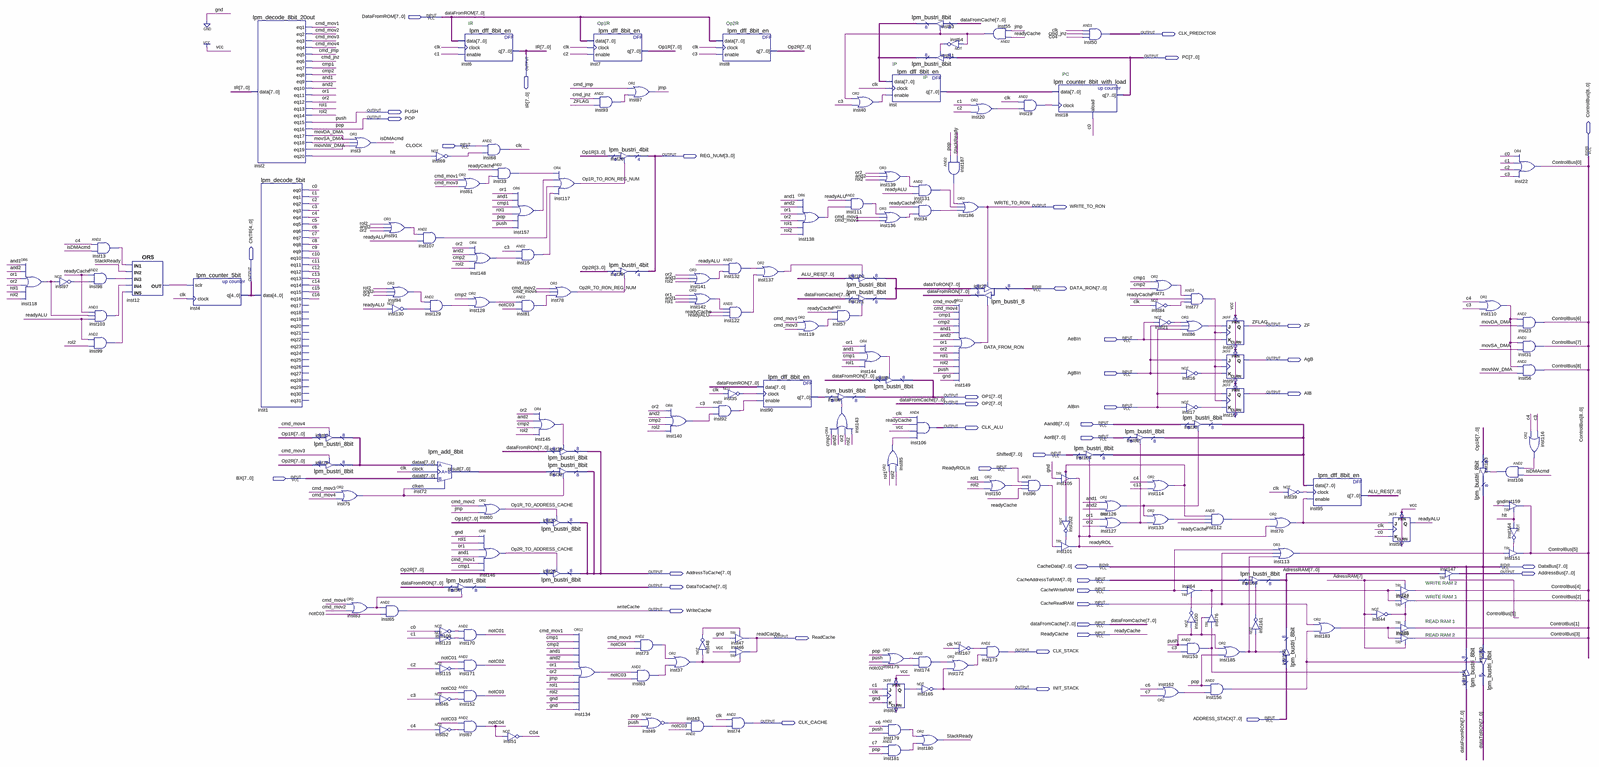
[diagram p0: schematic sheet, whole]
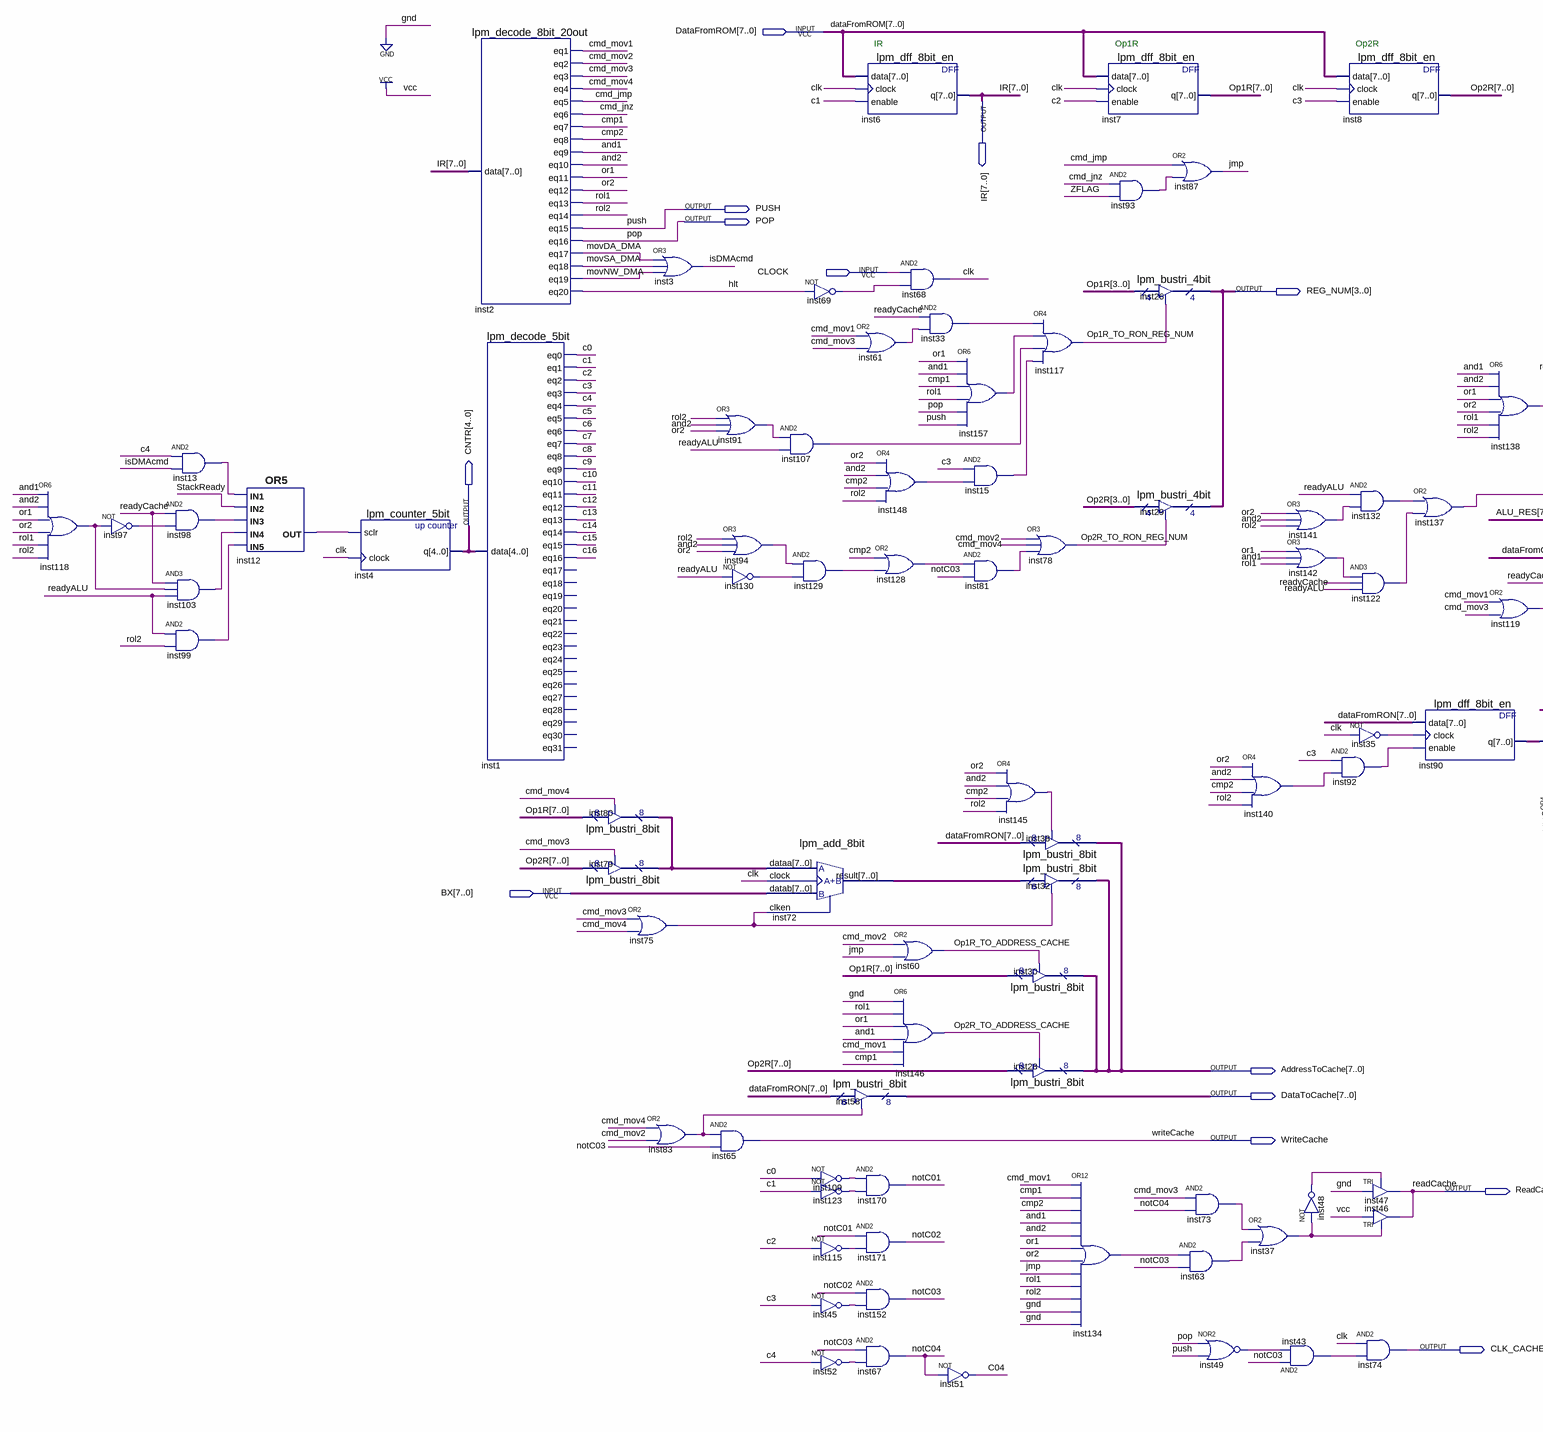
[diagram p1: schematic sheet, left part]
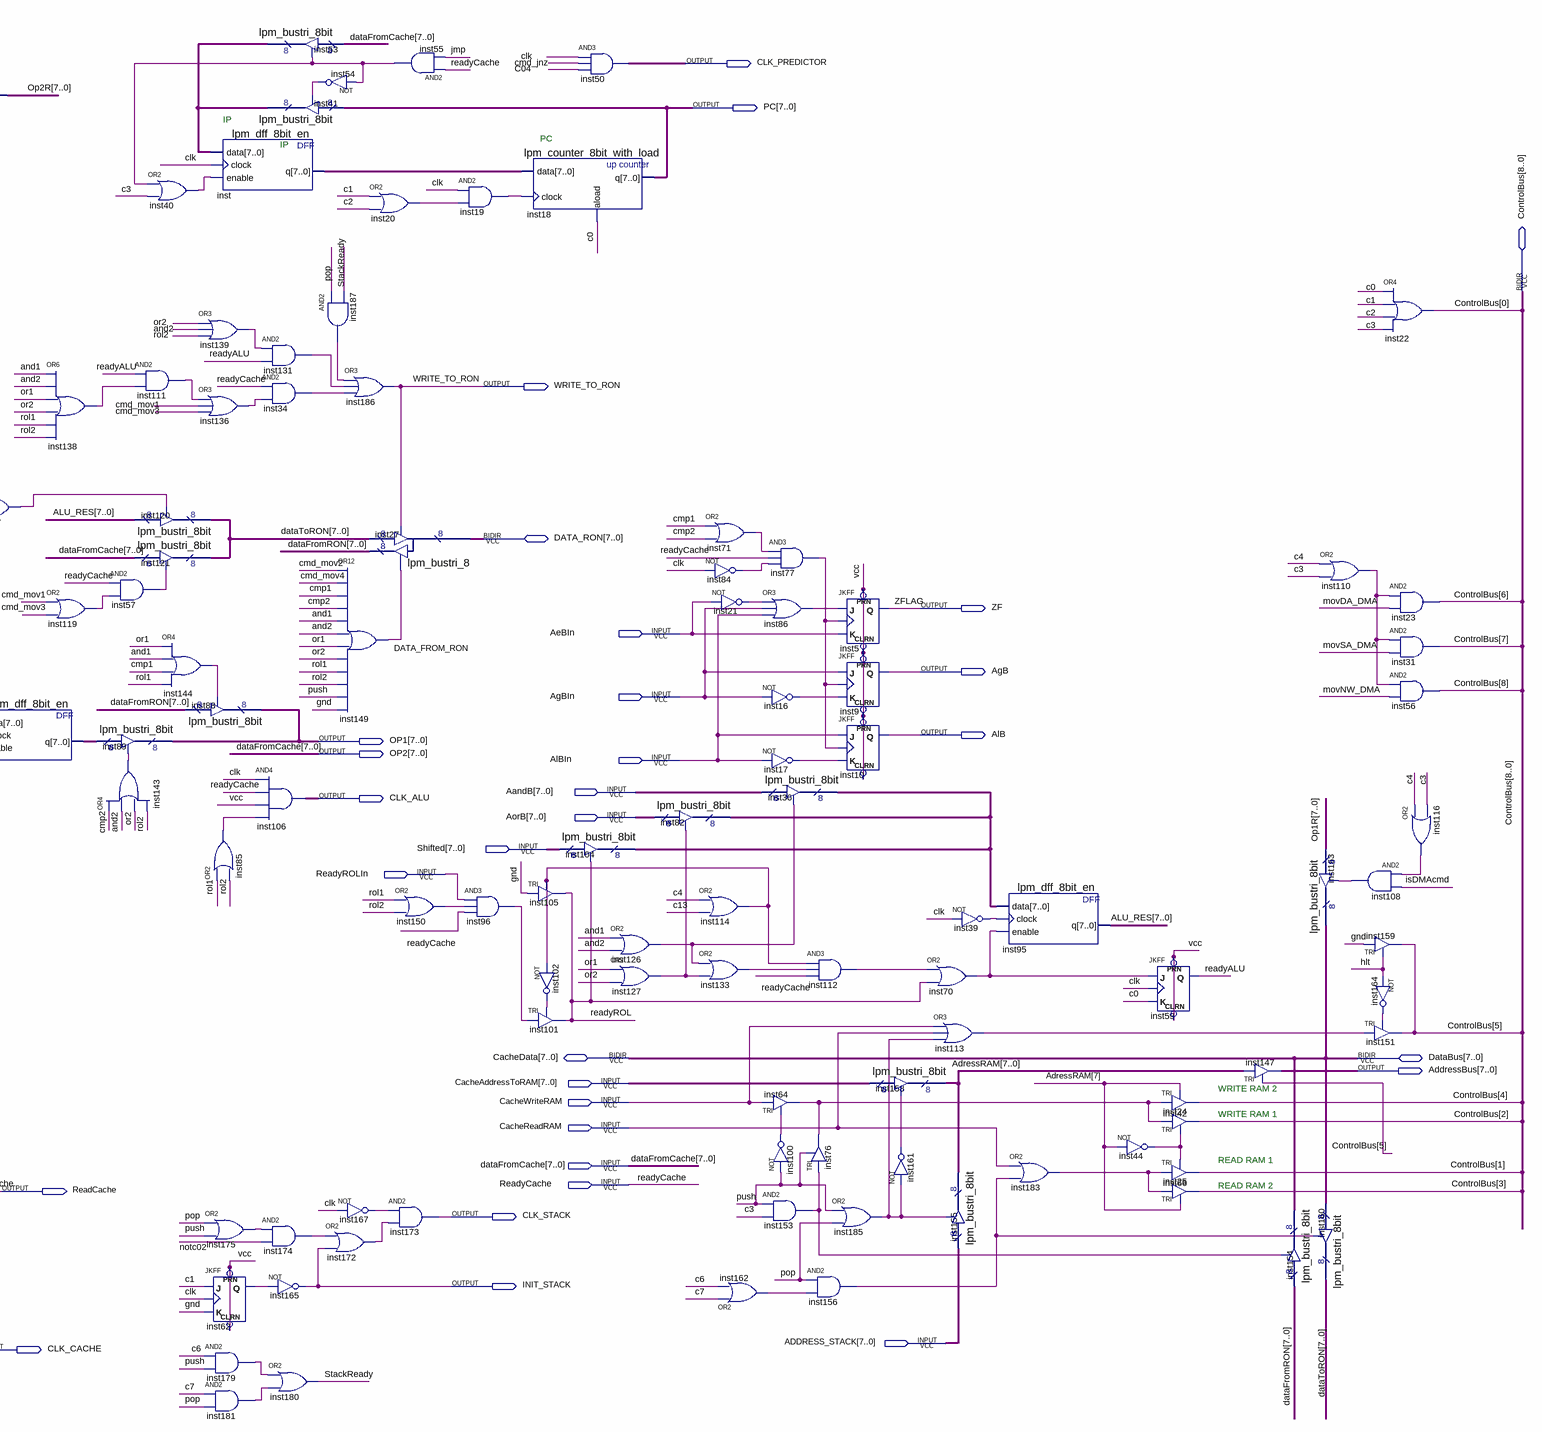
[diagram p2: schematic sheet, right part]
// Quartus schematic CPUManager.bdf as structural Verilog: 175 symbols, 42 pins
module CPUManager (
  input  [7:0] DataFromROM,
  input  CLOCK,
  input  AeBIn,
  input  AgBIn,
  input  AlBIn,
  input  [7:0] AandB,
  input  [7:0] AorB,
  input  [7:0] Shifted,
  input  ReadyROLIn,
  input  [7:0] BX,
  input  [7:0] CacheAddressToRAM,
  input  CacheWriteRAM,
  input  CacheReadRAM,
  input  [7:0] dataFromCache,
  input  ReadyCache,
  input  [7:0] ADDRESS_STACK,
  inout  [8:0] ControlBus,
  inout  [7:0] DATA_RON,
  inout  [7:0] CacheData,
  inout  [7:0] DataBus,
  output CLK_PREDICTOR,
  output [7:0] IR,
  output [7:0] PC,
  output PUSH,
  output POP,
  output [3:0] REG_NUM,
  output WRITE_TO_RON,
  output [4:0] CNTR,
  output ZF,
  output AgB,
  output AlB,
  output [7:0] OP1,
  output [7:0] OP2,
  output CLK_ALU,
  output [7:0] AddressToCache,
  output [7:0] AddressBus,
  output [7:0] DataToCache,
  output WriteCache,
  output ReadCache,
  output CLK_STACK,
  output INIT_STACK,
  output CLK_CACHE
);

  wire and1, and2, c0, c1, c2, c3, c4, C04, c5, c6, c7, c8, c9, c10, c11, c12, c13, c14, c15, c16, clk,
       cmd_jmp, cmd_jnz, cmd_mov1, cmd_mov2, cmd_mov3, cmd_mov4, cmp1, cmp2, DATA_FROM_RON, hlt, inst12_out,
       inst13_out, inst15_out, inst16_out, inst17_out, inst19_out, inst20_out, inst21_out, inst33_out,
       inst34_out, inst35_out, inst37_out, inst39_out, inst40_out, inst43_out, inst44_out, inst45_out,
       inst48_out, inst49_out, inst52_out, inst54_out, inst55_out, inst57_out, inst61_out, inst62_q,
       inst63_out, inst64_out, inst69_out, inst70_out, inst71_out, inst73_out, inst75_out, inst77_out,
       inst81_out, inst83_out, inst84_out, inst85_out, inst86_out, inst91_out, inst92_out, inst93_out,
       inst94_out, inst96_out, inst97_out, inst98_out, inst99_out, inst100_out, inst102_out, inst103_out,
       inst107_out, inst108_out, inst109_out, inst110_out, inst111_out, inst112_out, inst113_out,
       inst114_out, inst115_out, inst116_out, inst118_out, inst119_out, inst122_out, inst123_out,
       inst126_out, inst127_out, inst128_out, inst129_out, inst130_out, inst131_out, inst132_out,
       inst133_out, inst134_out, inst136_out, inst137_out, inst138_out, inst139_out, inst140_out,
       inst141_out, inst142_out, inst143_out, inst144_out, inst145_out, inst148_out, inst150_out,
       inst153_out, inst156_out, inst157_out, inst161_out, inst162_out, inst164_out, inst167_out,
       inst172_out, inst174_out, inst175_out, inst179_out, inst181_out, inst183_out, inst185_out,
       inst187_out, isDMAcmd, jmp, movDA_DMA, movNW_DMA, movSA_DMA, notC01, notC02, notC03, notC04,
       Op1R_TO_ADDRESS_CACHE, Op1R_TO_RON_REG_NUM, Op2R_TO_ADDRESS_CACHE, Op2R_TO_RON_REG_NUM, or1, or2,
       readyALU, readyROL, rol1, rol2, StackReady;
  wire [7:0] AdressRAM, ALU_RES, dataFromRON, dataToRON, inst53_tridata, inst72_result, inst80_tridata,
       inst90_q, inst104_tridata, inst_q, Op1R, Op2R;

  or inst118 (inst118_out, and1, and2, or1, or2, rol1, rol2);
  not inst97 (inst97_out, inst118_out);
  and inst13 (inst13_out, c4, isDMAcmd);
  and inst98 (inst98_out, ReadyCache, inst97_out);
  and inst103 (inst103_out, ReadyCache, inst118_out, readyALU);
  and inst99 (inst99_out, readyALU, rol2);
  or inst12 (inst12_out, inst13_out, StackReady, inst98_out, inst103_out, inst99_out);
  lpm_counter_5bit inst4 (.sclr(inst12_out), .clock(clk), .q(CNTR));
  lpm_decode_8bit_20out inst2 (
    .data(IR), .eq1(cmd_mov1), .eq2(cmd_mov2), .eq3(cmd_mov3), .eq4(cmd_mov4), .eq5(cmd_jmp), .eq6(cmd_jnz),
    .eq7(cmp1), .eq8(cmp2), .eq9(and1), .eq10(and2), .eq11(or1), .eq12(or2), .eq13(rol1), .eq14(rol2),
    .eq15(PUSH), .eq16(POP), .eq17(movDA_DMA), .eq18(movSA_DMA), .eq19(movNW_DMA), .eq20(hlt));
  lpm_decode_5bit inst1 (
    .data(CNTR), .eq0(c0), .eq1(c1), .eq2(c2), .eq3(c3), .eq4(c4), .eq5(c5), .eq6(c6), .eq7(c7), .eq8(c8),
    .eq9(c9), .eq10(c10), .eq11(c11), .eq12(c12), .eq13(c13), .eq14(c14), .eq15(c15), .eq16(c16));  // open: eq17, eq18, eq19, eq20, eq21, eq22, eq23, eq24, eq25, eq26, eq27, eq28, eq29, eq30, eq31
  lpm_bustri_8bit inst80 (.enabledt(cmd_mov4), .data(Op1R), .tridata(inst80_tridata));
  lpm_bustri_8bit inst79 (.enabledt(cmd_mov3), .data(Op2R), .tridata(inst80_tridata));
  or inst3 (isDMAcmd, movDA_DMA, movSA_DMA, movNW_DMA);
  or inst75 (inst75_out, cmd_mov3, cmd_mov4);
  or inst83 (inst83_out, cmd_mov4, cmd_mov2);
  or inst91 (inst91_out, rol2, and2, or2);
  and inst65 (WriteCache, inst83_out, notC03);
  or inst94 (inst94_out, rol2, and2, or2);
  not inst130 (inst130_out, readyALU);
  lpm_add_8bit inst72 (.dataa(inst80_tridata), .datab(BX), .clock(clk), .clken(inst75_out), .result(inst72_result));
  not inst69 (inst69_out, hlt);
  and inst107 (inst107_out, inst91_out, readyALU);
  and inst129 (inst129_out, inst94_out, inst130_out);
  not inst109 (inst109_out, c0);
  not inst123 (inst123_out, c1);
  not inst115 (inst115_out, c2);
  not inst45 (inst45_out, c3);
  not inst52 (inst52_out, c4);
  lpm_dff_8bit_en inst6 (.data(DataFromROM), .clock(clk), .enable(c1), .q(IR));
  or inst61 (inst61_out, cmd_mov1, cmd_mov3);
  lpm_bustri_8bit inst58 (.enabledt(inst83_out), .data(dataFromRON), .tridata(DataToCache));
  and inst170 (notC01, inst109_out, inst123_out);
  and inst171 (notC02, notC01, inst115_out);
  and inst152 (notC03, notC02, inst45_out);
  and inst67 (notC04, notC03, inst52_out);
  and inst68 (clk, CLOCK, inst69_out);
  and inst33 (inst33_out, ReadyCache, inst61_out);
  or inst148 (inst148_out, or2, and2, cmp2, rol2);
  or inst128 (inst128_out, cmp2, inst129_out);
  or inst60 (Op1R_TO_ADDRESS_CACHE, cmd_mov2, jmp);
  or inst146 (Op2R_TO_ADDRESS_CACHE, 1'b0, rol1, or1, and1, cmd_mov1, cmp1);
  or inst157 (inst157_out, or1, and1, cmp1, rol1, POP, PUSH);
  and inst15 (inst15_out, c3, inst148_out);
  and inst81 (inst81_out, inst128_out, notC03);
  not inst51 (C04, notC04);
  or inst145 (inst145_out, or2, and2, cmp2, rol2);
  lpm_bustri_8bit inst38 (.enabledt(inst145_out), .data(dataFromRON), .tridata(AddressToCache));
  lpm_bustri_8bit inst32 (.enabledt(inst75_out), .data(inst72_result), .tridata(AddressToCache));
  lpm_bustri_8bit inst30 (.enabledt(Op1R_TO_ADDRESS_CACHE), .data(Op1R), .tridata(AddressToCache));
  lpm_bustri_8bit inst28 (.enabledt(Op2R_TO_ADDRESS_CACHE), .data(Op2R), .tridata(AddressToCache));
  or inst117 (Op1R_TO_RON_REG_NUM, inst33_out, inst157_out, inst107_out, inst15_out);
  or inst78 (Op2R_TO_RON_REG_NUM, cmd_mov2, cmd_mov4, inst81_out);
  or inst134 (inst134_out, cmd_mov1, cmp1, cmp2, and1, and2, or1, or2, jmp, rol1, rol2, 1'b0, 1'b0);
  lpm_dff_8bit_en inst7 (.data(DataFromROM), .clock(clk), .enable(c2), .q(Op1R));
  and inst93 (inst93_out, cmd_jnz, ZF);
  or inst87 (jmp, cmd_jmp, inst93_out);
  lpm_bustri_4bit inst26 (.enabledt(Op1R_TO_RON_REG_NUM), .data(Op1R[3:0]), .tridata(REG_NUM));
  lpm_bustri_4bit inst29 (.enabledt(Op2R_TO_RON_REG_NUM), .data(Op2R[3:0]), .tridata(REG_NUM));
  and inst73 (inst73_out, cmd_mov3, notC04);
  and inst63 (inst63_out, inst134_out, notC03);
  nor inst49 (inst49_out, POP, PUSH);
  or inst140 (inst140_out, or2, and2, cmp2, rol2);
  or inst37 (inst37_out, inst73_out, inst63_out);
  or inst141 (inst141_out, or2, and2, rol2);
  or inst142 (inst142_out, or1, and1, rol1);
  not inst48 (inst48_out, inst37_out);
  and inst43 (inst43_out, notC03, inst49_out);
  lpm_dff_8bit_en inst8 (.data(DataFromROM), .clock(clk), .enable(c3), .q(Op2R));
  and inst132 (inst132_out, readyALU, inst141_out);
  and inst122 (inst122_out, inst142_out, ReadyCache, readyALU);
  not inst35 (inst35_out, clk);
  and inst92 (inst92_out, c3, inst140_out);
  TRI inst47 (.IN(1'b0), .OE(inst48_out), .OUT(ReadCache));
  TRI inst46 (.IN(1'b1), .OE(inst37_out), .OUT(ReadCache));
  and inst74 (CLK_CACHE, clk, inst43_out);
  or inst137 (inst137_out, inst132_out, inst122_out);
  lpm_dff_8bit_en inst90 (.data(dataFromRON), .clock(inst35_out), .enable(inst92_out), .q(inst90_q));
  or inst138 (inst138_out, and1, and2, or1, or2, rol1, rol2);
  or inst119 (inst119_out, cmd_mov1, cmd_mov3);
  and inst111 (inst111_out, readyALU, inst138_out);
  lpm_bustri_8bit inst120 (.enabledt(inst137_out), .data(ALU_RES), .tridata(dataToRON));
  lpm_bustri_8bit inst121 (.enabledt(inst57_out), .data(dataFromCache), .tridata(dataToRON));
  and inst57 (inst57_out, ReadyCache, inst119_out);
  lpm_bustri_8bit inst89 (.enabledt(inst143_out), .data(inst90_q), .tridata(OP1));
  or inst143 (inst143_out, cmp2, and2, or2, rol2);
  or inst40 (inst40_out, inst55_out, c3);
  or inst144 (inst144_out, or1, and1, cmp1, rol1);
  lpm_bustri_8bit inst88 (.enabledt(inst144_out), .data(dataFromRON), .tridata(OP1));
  lpm_dff_8bit_en inst (.data(inst53_tridata), .clock(clk), .enable(inst40_out), .q(inst_q));
  or inst139 (inst139_out, or2, and2, rol2);
  or inst136 (inst136_out, inst111_out, cmd_mov1, cmd_mov3);
  or inst85 (inst85_out, rol1, rol2);
  or inst175 (inst175_out, POP, PUSH);
  JKFF inst62 (.PRN(1'b1), .CLRN(1'b1), .K(1'b0), .J(c1), .CLK(clk), .Q(inst62_q));
  and inst179 (inst179_out, c6, PUSH);
  and inst181 (inst181_out, c7, POP);
  lpm_bustri_8bit inst53 (.enabledt(inst55_out), .data(dataFromCache), .tridata(inst53_tridata));
  lpm_bustri_8bit inst41 (.enabledt(inst54_out), .data(PC), .tridata(inst53_tridata));
  and inst131 (inst131_out, inst139_out, readyALU);
  and inst34 (inst34_out, ReadyCache, inst136_out);
  and inst106 (CLK_ALU, clk, ReadyCache, 1'b1, inst85_out);
  and inst174 (inst174_out, inst175_out, notC02);
  not inst165 (INIT_STACK, inst62_q);
  or inst180 (StackReady, inst179_out, inst181_out);
  not inst54 (inst54_out, inst55_out);
  and inst187 (inst187_out, POP, StackReady);
  or inst149 (DATA_FROM_RON, cmd_mov2, cmd_mov4, cmp1, cmp2, and1, and2, or1, or2, rol1, rol2, PUSH, 1'b0);
  not inst167 (inst167_out, clk);
  or inst172 (inst172_out, inst174_out, INIT_STACK);
  or inst20 (inst20_out, c1, c2);
  or inst186 (WRITE_TO_RON, inst187_out, inst131_out, inst34_out);
  lpm_bustri_8 inst27 (
    .enabledt(WRITE_TO_RON), .data(dataToRON), .enabletr(DATA_FROM_RON), .result(dataFromRON),
    .tridata(DATA_RON));
  and inst173 (CLK_STACK, inst167_out, inst172_out);
  and inst55 (inst55_out, ReadyCache, jmp);
  or inst150 (inst150_out, rol1, rol2);
  and inst19 (inst19_out, clk, inst20_out);
  and inst96 (inst96_out, ReadyROLIn, inst150_out, ReadyCache);
  lpm_counter_8bit_with_load inst18 (.data(inst_q), .clock(inst19_out), .aload(c0), .q(PC));
  TRI inst105 (.IN(1'b0), .OE(inst114_out), .OUT(readyROL));
  not inst102 (inst102_out, inst114_out);
  TRI inst101 (.IN(inst96_out), .OE(inst102_out), .OUT(readyROL));
  and inst50 (CLK_PREDICTOR, clk, cmd_jnz, C04);
  lpm_bustri_8bit inst104 (.enabledt(readyROL), .data(Shifted), .tridata(inst104_tridata));
  or inst126 (inst126_out, and1, and2);
  or inst127 (inst127_out, or1, or2);
  lpm_bustri_8bit inst82 (.enabledt(inst127_out), .data(AorB), .tridata(inst104_tridata));
  or inst71 (inst71_out, cmp1, cmp2);
  not inst84 (inst84_out, clk);
  not inst21 (inst21_out, AeBIn);
  or inst114 (inst114_out, c4, c13);
  or inst133 (inst133_out, inst126_out, inst127_out);
  or inst162 (inst162_out, c7, c6);
  and inst77 (inst77_out, inst71_out, ReadyCache, inst84_out);
  or inst86 (inst86_out, inst21_out, AgBIn, AlBIn);
  not inst16 (inst16_out, AgBIn);
  not inst17 (inst17_out, AlBIn);
  lpm_bustri_8bit inst36 (.enabledt(inst126_out), .data(AandB), .tridata(inst104_tridata));
  TRI inst64 (.IN(CacheWriteRAM), .OE(inst100_out), .OUT(inst64_out));
  not inst100 (inst100_out, PUSH);
  and inst153 (inst153_out, PUSH, c3);
  JKFF inst5 (.PRN(1'b1), .CLRN(1'b1), .K(AeBIn), .J(inst86_out), .CLK(inst77_out), .Q(ZF));
  JKFF inst9 (.PRN(1'b1), .CLRN(1'b1), .K(inst16_out), .J(AgBIn), .CLK(inst77_out), .Q(AgB));
  JKFF inst10 (.PRN(1'b1), .CLRN(1'b1), .K(inst17_out), .J(AlBIn), .CLK(inst77_out), .Q(AlB));
  and inst112 (inst112_out, inst114_out, inst133_out, ReadyCache);
  TRI inst76 (.IN(inst153_out), .OE(PUSH), .OUT(inst64_out));
  or inst185 (inst185_out, PUSH, POP);
  and inst156 (inst156_out, POP, inst162_out);
  lpm_bustri_8bit inst158 (.enabledt(inst161_out), .data(CacheAddressToRAM), .tridata(AdressRAM));
  not inst161 (inst161_out, inst185_out);
  or inst70 (inst70_out, inst112_out, readyROL);
  or inst113 (inst113_out, CacheWriteRAM, CacheReadRAM, inst185_out);
  lpm_bustri_8bit inst155 (.enabledt(inst185_out), .data(ADDRESS_STACK), .tridata(AdressRAM));
  lpm_dff_8bit_en inst95 (.data(inst104_tridata), .clock(inst39_out), .enable(inst70_out), .q(ALU_RES));
  not inst39 (inst39_out, clk);
  or inst183 (inst183_out, CacheReadRAM, inst156_out);
  JKFF inst59 (.PRN(1'b1), .CLRN(1'b1), .K(c0), .J(inst70_out), .CLK(clk), .Q(readyALU));
  not inst44 (inst44_out, AdressRAM[7]);
  TRI inst24 (.IN(inst64_out), .OE(AdressRAM[7]), .OUT(ControlBus[4]));
  TRI inst42 (.IN(inst64_out), .OE(inst44_out), .OUT(ControlBus[2]));
  TRI inst25 (.IN(inst183_out), .OE(inst44_out), .OUT(ControlBus[1]));
  TRI inst66 (.IN(inst183_out), .OE(AdressRAM[7]), .OUT(ControlBus[3]));
  TRI inst147[7:0] (.IN(AdressRAM), .OE(ControlBus[5]), .OUT(AddressBus));
  lpm_bustri_8bit inst154 (.enabledt(inst153_out), .data(dataFromRON), .tridata(CacheData));
  or inst110 (inst110_out, c4, c3);
  lpm_bustri_8bit inst163 (.enabledt(inst108_out), .data(Op1R), .tridata(CacheData));
  and inst108 (inst108_out, inst116_out, isDMAcmd);
  lpm_bustri_8bit inst160 (.enabledt(inst156_out), .data(CacheData), .tridata(dataToRON));
  or inst22 (ControlBus[0], c0, c1, c2, c3);
  and inst23 (ControlBus[6], inst110_out, movDA_DMA);
  and inst31 (ControlBus[7], inst110_out, movSA_DMA);
  and inst56 (ControlBus[8], inst110_out, movNW_DMA);
  or inst116 (inst116_out, c4, c3);
  TRI inst159 (.IN(1'b0), .OE(hlt), .OUT(ControlBus[5]));
  not inst164 (inst164_out, hlt);
  TRI inst151 (.IN(inst113_out), .OE(inst164_out), .OUT(ControlBus[5]));

  assign DataBus = CacheData;
  assign OP2 = dataFromCache;

  // Other names for the same wires on the sheet: ZFLAG = ZF

  // Notes on the sheet:
  //   IR
  //   Op1R
  //   Op2R
  //   IP
  //   PC
  //   IP
  //   WRITE RAM 2
  //   WRITE RAM 1
  //   READ RAM 1
  //   READ RAM 2
endmodule
